# EAGLE design SensorStick_v2 (EAGLE 9.4.2)
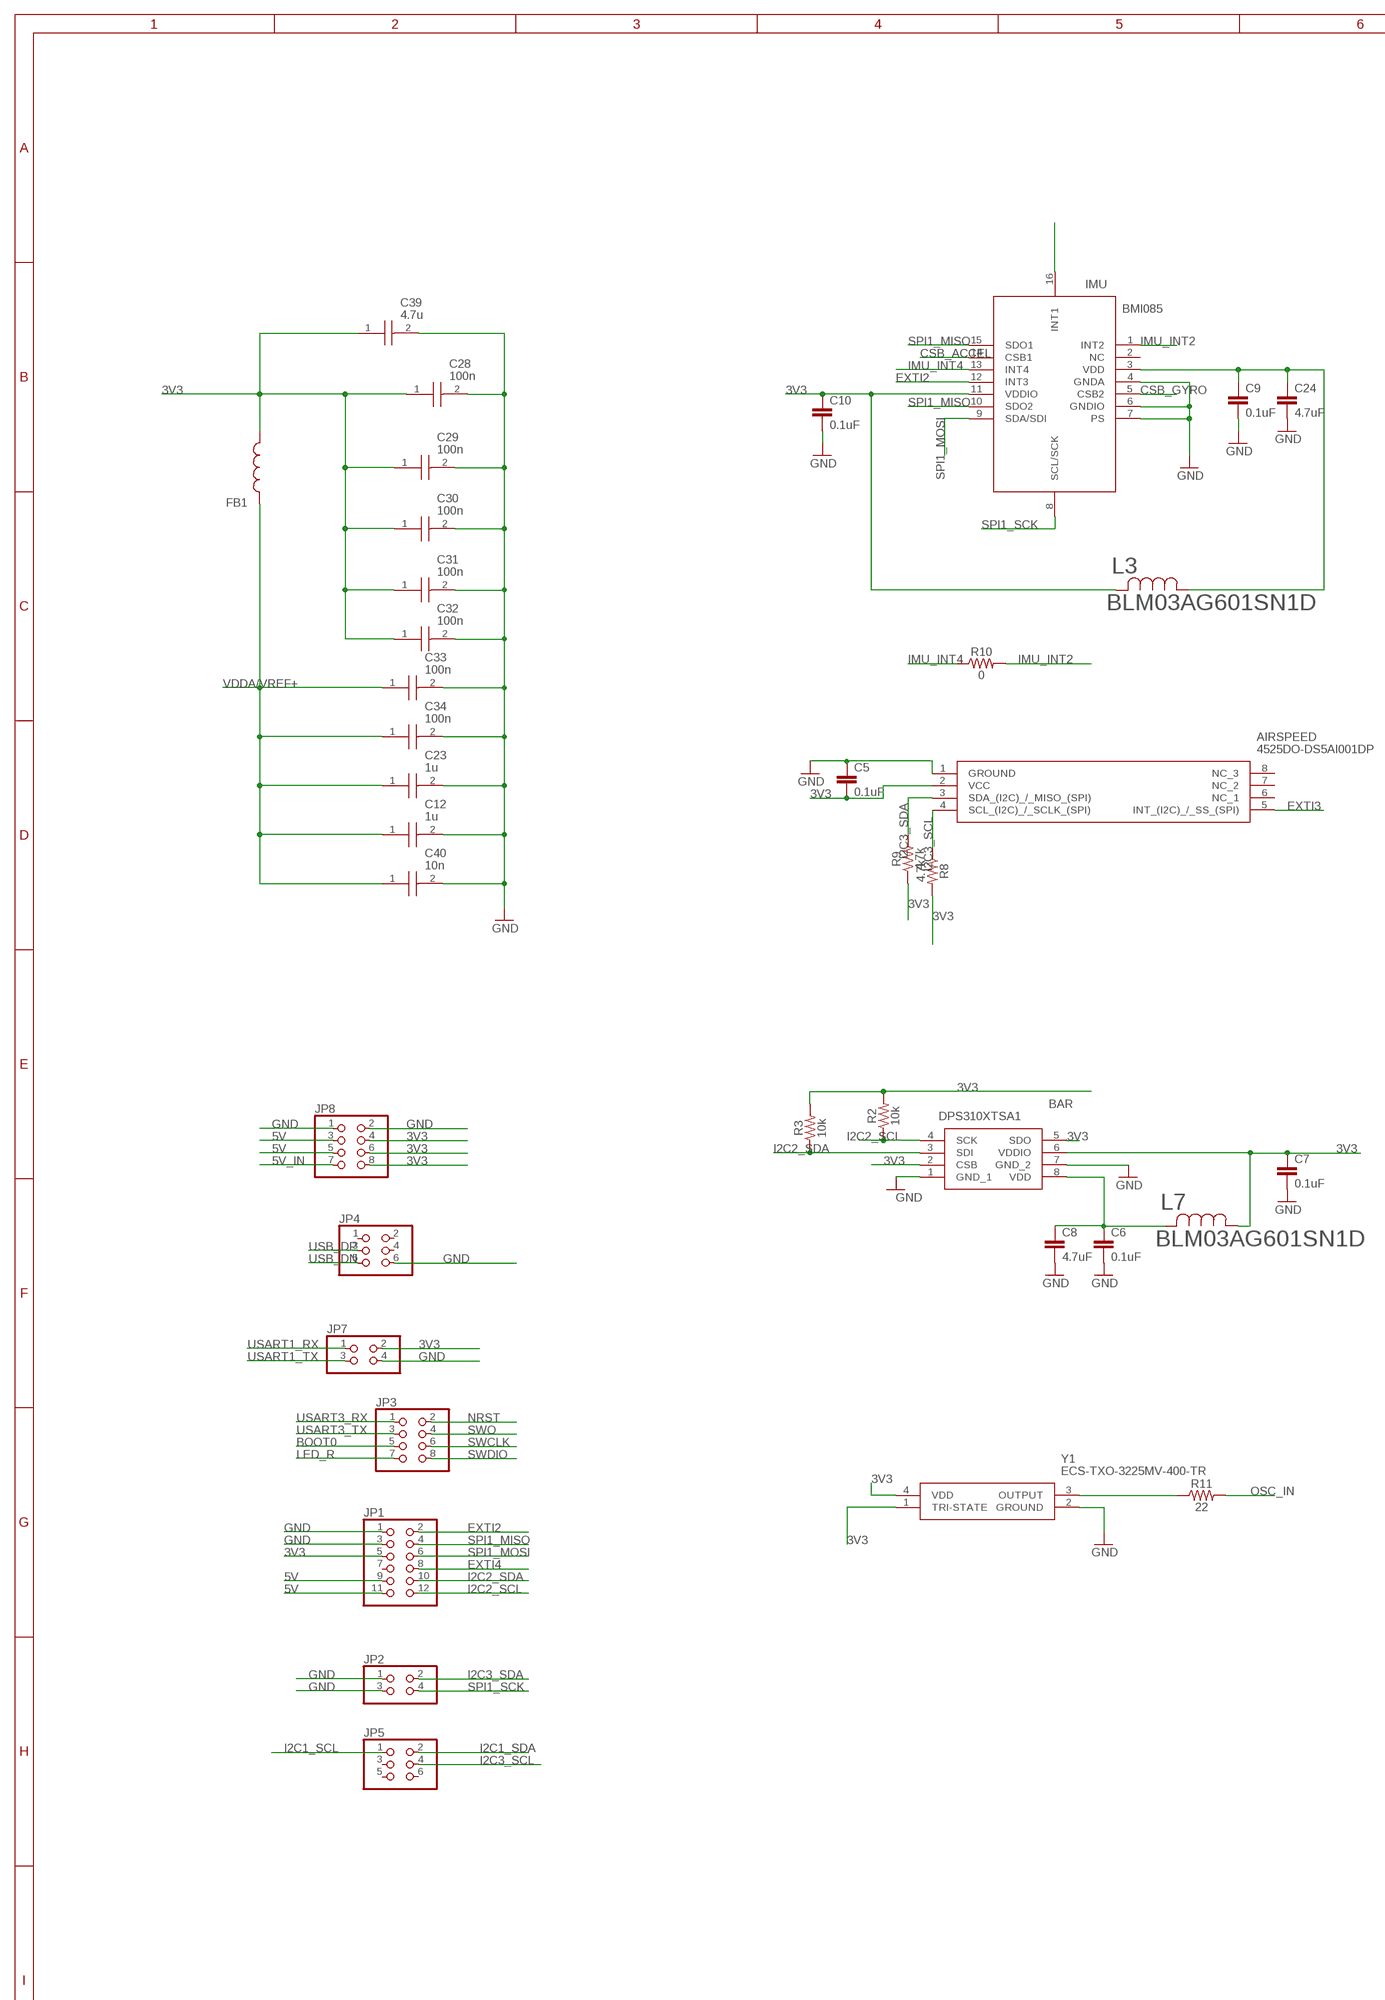
[diagram p0: schematic, sheet 1, part 1 of 2]
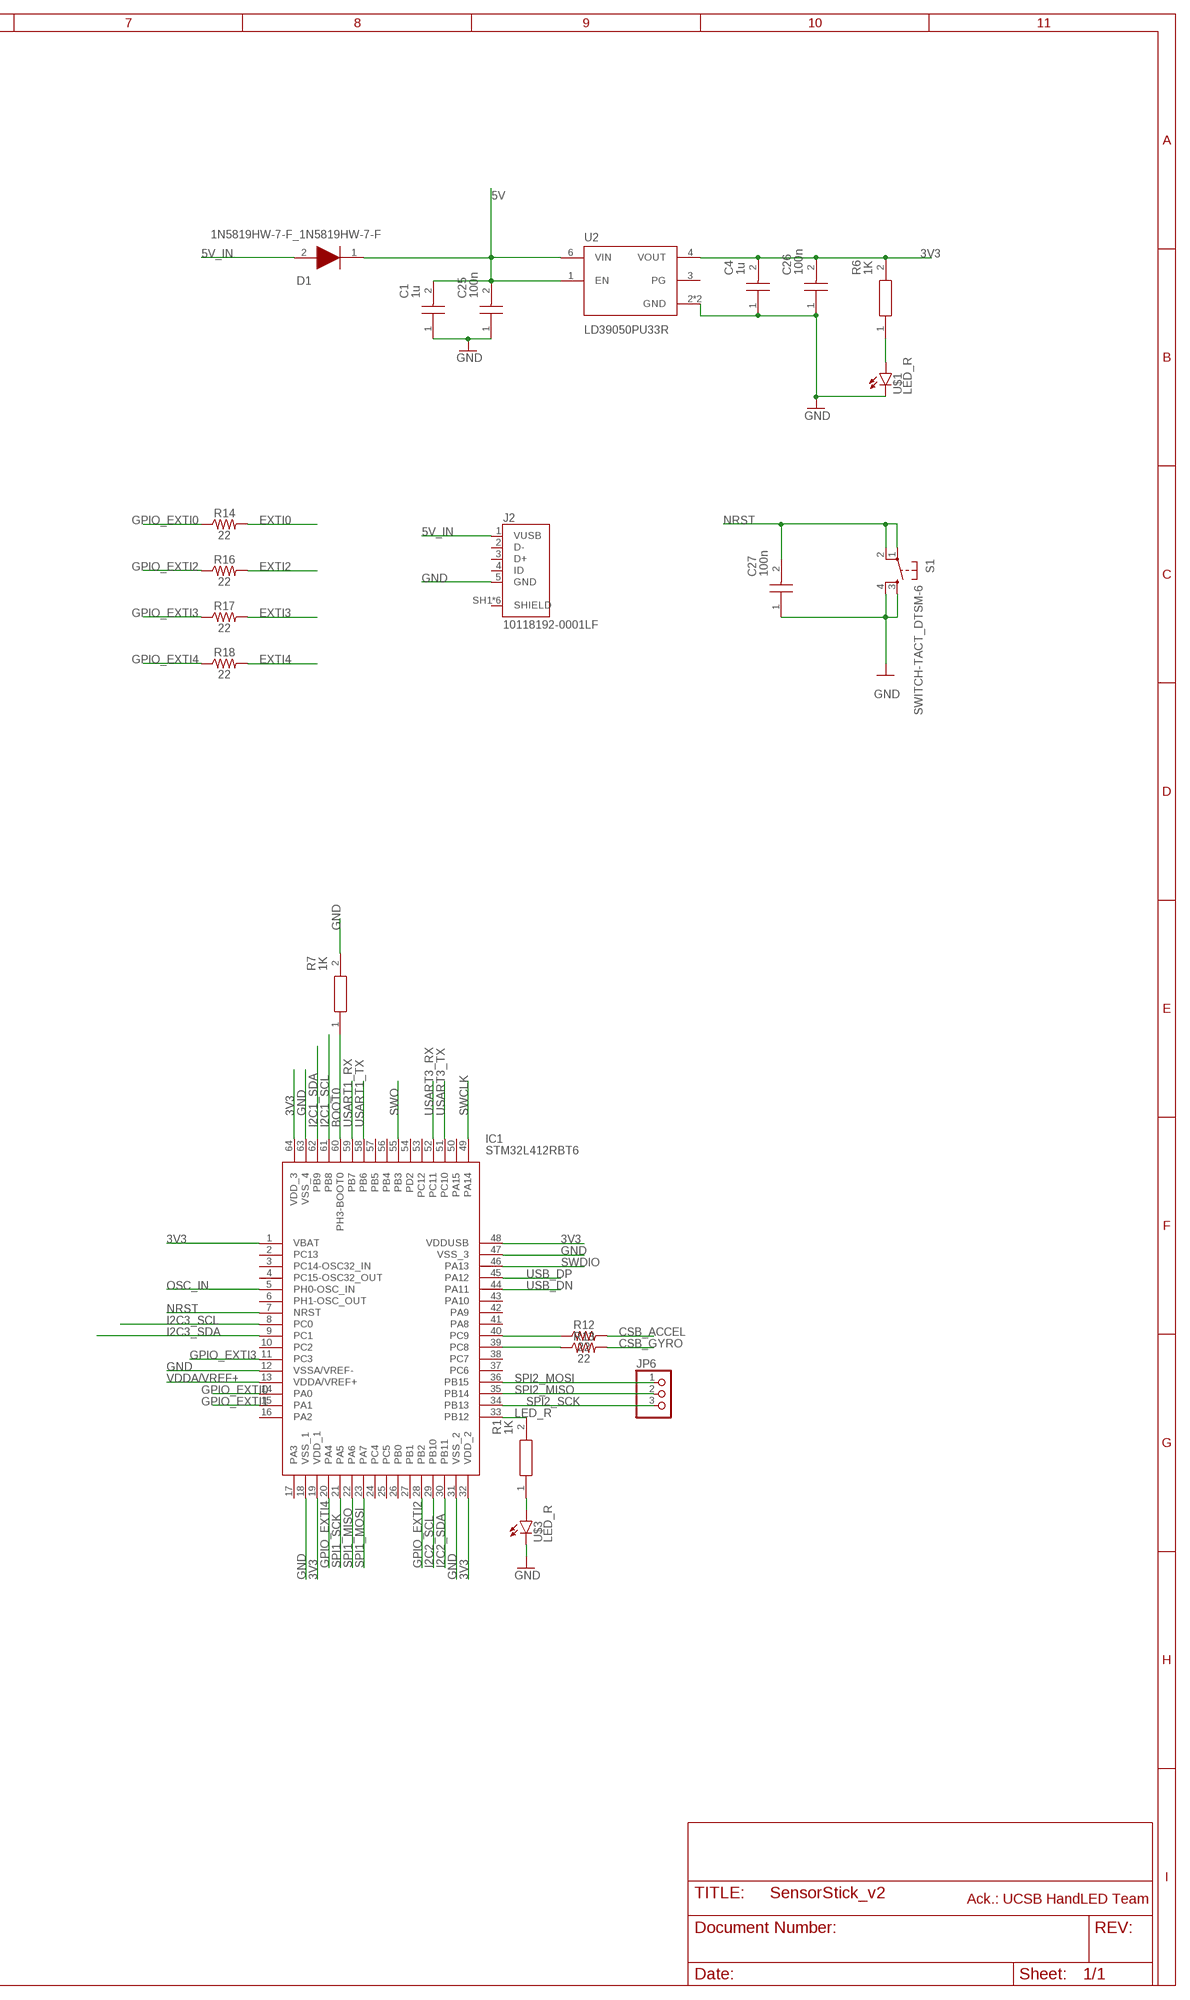
[diagram p1: schematic, sheet 1, part 2 of 2]

## Parts
AIRSPEED  4525DO-DS5AI001DP  [4525DO-DS...P]
BAR  DPS310XTSA1  [DPS310XTSA1]
C1  1u  GRM219R61H105KA73D  [CAPC2012X95N]
C4  1u  GRM219R61H105KA73D  [CAPC2012X95N]
C5  0.1uF  0.1UF-0402-6.3V-10%-X7R  [0402]
C6  0.1uF  0.1UF-0402-6.3V-10%-X7R  [0402]
C7  0.1uF  0.1UF-0402-6.3V-10%-X7R  [0402]
C8  4.7uF  4.7UF0603  [0603]
C9  0.1uF  0.1UF-0402-6.3V-10%-X7R  [0402]
C10  0.1uF  0.1UF-0402-6.3V-10%-X7R  [0402]
C12  1u  GRM219R61H105KA73D  [CAPC2012X95N]
C23  1u  GRM219R61H105KA73D  [CAPC2012X95N]
C24  4.7uF  4.7UF0603  [0603]
C25  100n  GRT31C5C2A104JA12L  [CAPC3216X180N]
C26  100n  GRT31C5C2A104JA12L  [CAPC3216X180N]
C27  100n  GRT31C5C2A104JA12L  [CAPC3216X180N]
C28  100n  GRT31C5C2A104JA12L  [CAPC3216X180N]
C29  100n  GRT31C5C2A104JA12L  [CAPC3216X180N]
C30  100n  GRT31C5C2A104JA12L  [CAPC3216X180N]
C31  100n  GRT31C5C2A104JA12L  [CAPC3216X180N]
C32  100n  GRT31C5C2A104JA12L  [CAPC3216X180N]
C33  100n  GRT31C5C2A104JA12L  [CAPC3216X180N]
C34  100n  GRT31C5C2A104JA12L  [CAPC3216X180N]
C39  4.7u  GRT21BC71H475KE13L  [CAPC2012X145N]
C40  10n  GRM31CR73A103KW03L  [CAPC3216X180N]
D1  1N5819HW-7-F_1N5819HW-7-F  [1N5819HW-7-F_SOD3716X145N]
FB1  BK1608HS601-T  [BEADC1608X95N]
IC1  STM32L412RBT6  STM32L412RBT6P  [QFP50P1200X1200X160-64N]
IMU  BMI085  [BMI085]
J2  10118192-0001LF  [AMPHENOL_10118192-0001LF]
JP1  PINHD-2X6  [2X06]
JP2  PINHD-2X2  [2X02]
JP3  PINHD-2X4  [2X04]
JP4  PINHD-2X3  [2X03]
JP5  PINHD-2X3  [2X03]
JP6  PINHD-1X3  [1X03]
JP7  PINHD-2X2  [2X02]
JP8  PINHD-2X4  [2X04]
L3  BLM03AG601SN1D  [IND_BLM03_0201_MUR]
L7  BLM03AG601SN1D  [IND_BLM03_0201_MUR]
R1  1K  RC0805FR-131KL  [RESC2012X60N]
R2  10k  10KOHM-0402-1/16W-1%  [0402]
R3  10k  10KOHM-0402-1/16W-1%  [0402]
R6  1K  RC0805FR-131KL  [RESC2012X60N]
R7  1K  RC0805FR-131KL  [RESC2012X60N]
R8  4.7k  4.7KOHM-0603-1/10W-1%  [0603]
R9  4.7k  4.7KOHM-0603-1/10W-1%  [0603]
R10  0  0OHM-0603-1/10W-5%  [0603]
R11  22  22OHM-0402-1/10W-1%  [0402]
R12  22  22OHM-0402-1/10W-1%  [0402]
R13  22  22OHM-0402-1/10W-1%  [0402]
R14  22  22OHM-0402-1/10W-1%  [0402]
R16  22  22OHM-0402-1/10W-1%  [0402]
R17  22  22OHM-0402-1/10W-1%  [0402]
R18  22  22OHM-0402-1/10W-1%  [0402]
S1  SWITCH-TACT_DTSM-6  [SWITCH-TACT_DTSM-6]
U2  LD39050PU33R  [SON95P300X300X100-7N]
U$1  LED_R  SML-P12VTT86  [LED_SML-P11UTT86R]
U$3  LED_R  SML-P12VTT86  [LED_SML-P11UTT86R]
Y1  ECS-TXO-3225MV-400-TR  [ECSTXO3225MV400TR]

## Nets
3V3: AIRSPEED.2(VCC) BAR.2(CSB) BAR.5(SDO) BAR.6(VDDIO) C4.2 C5.2 C7.1 C10.1 C26.2 C28.1 C29.1 C30.1 C31.1 C32.1 C39.1 FB1.2 IC1.1(VBAT) IC1.19(VDD_1) IC1.32(VDD_2) IC1.48(VDDUSB) IC1.64(VDD_3) IMU.11(VDDIO) JP1.5 JP7.2 JP8.4 JP8.6 JP8.8 L3.2 L7.1 R2.2 R3.2 R6.2 R8.2 R9.1 U2.4(VOUT) Y1.1(TRI-STATE) Y1.4(VDD)
5V: C1.2 C25.2 D1.1(K) JP1.9 JP1.11 JP8.3 JP8.5 U2.1(EN) U2.6(VIN)
5V_IN: D1.2(A) J2.1(VUSB) JP8.7
BOOT0: IC1.60(PH3-BOOT0) JP3.5 R7.1
CSB_ACCEL: IMU.14(CSB1) R12.2
CSB_GYRO: IMU.5(CSB2) R13.2
EXTI0: IMU.16(INT1) R14.2
EXTI2: IMU.12(INT3) JP1.2 R16.2
EXTI3: AIRSPEED.5(INT_(I2C)_/_SS_(SPI)) R17.2
EXTI4: JP1.8 R18.2
GND: AIRSPEED.1(GROUND) BAR.1(GND_1) BAR.7(GND_2) C1.1 C4.1 C5.1 C6.2 C7.2 C8.2 C9.2 C10.2 C12.2 C23.2 C24.2 C25.1 C26.1 C27.1 C28.2 C29.2 C30.2 C31.2 C32.2 C33.2 C34.2 C39.2 C40.2 IC1.12(VSSA/VREF-) IC1.18(VSS_1) IC1.31(VSS_2) IC1.47(VSS_3) IC1.63(VSS_4) IMU.4(GNDA) IMU.6(GNDIO) IMU.7(PS) J2.5(GND) JP1.1 JP1.3 JP2.1 JP2.3 JP4.6 JP7.4 JP8.1 JP8.2 R7.2 S1.3 S1.4 U2.2(GND) U2.7(GND) U$1.C U$3.C Y1.2(GROUND)
GPIO_EXTI0: IC1.14(PA0) R14.1
GPIO_EXTI1: IC1.15(PA1)
GPIO_EXTI2: IC1.28(PB2) R16.1
GPIO_EXTI3: IC1.11(PC3) R17.1
GPIO_EXTI4: IC1.20(PA4) R18.1
I2C1_SCL: IC1.61(PB8) JP5.1
I2C1_SDA: IC1.62(PB9) JP5.2
I2C2_SCL: BAR.4(SCK) IC1.29(PB10) JP1.12 R2.1
I2C2_SDA: BAR.3(SDI) IC1.30(PB11) JP1.10 R3.1
I2C3_SCL: AIRSPEED.4(SCL_(I2C)_/_SCLK_(SPI)) IC1.8(PC0) JP5.4 R8.1
I2C3_SDA: AIRSPEED.3(SDA_(I2C)_/_MISO_(SPI)) IC1.9(PC1) JP2.2 R9.2
IMU_INT2: IMU.1(INT2) R10.2
IMU_INT4: IMU.13(INT4) R10.1
LED_R: IC1.33(PB12) JP3.7 R1.2
N$1: IC1.39(PC8) R13.1
N$2: R1.1 U$3.A
N$3: R11.1 Y1.3(OUTPUT)
N$4: IC1.40(PC9) R12.1
N$5: R6.1 U$1.A
N$6: BAR.8(VDD) C6.1 C8.1 L7.2
N$8: C9.1 C24.1 IMU.3(VDD) L3.1
NRST: C27.2 IC1.7(NRST) JP3.2 S1.1 S1.2
OSC_IN: IC1.5(PH0-OSC_IN) R11.2
SPI1_MISO: IC1.22(PA6) IMU.10(SDO2) IMU.15(SDO1) JP1.4
SPI1_MOSI: IC1.23(PA7) IMU.9(SDA/SDI) JP1.6
SPI1_SCK: IC1.21(PA5) IMU.8(SCL/SCK) JP2.4
SPI2_MISO: IC1.35(PB14) JP6.2
SPI2_MOSI: IC1.36(PB15) JP6.1
SPI2_SCK: IC1.34(PB13) JP6.3
SWCLK: IC1.49(PA14) JP3.6
SWDIO: IC1.46(PA13) JP3.8
SWO: IC1.55(PB3) JP3.4
USART1_RX: IC1.59(PB7) JP7.1
USART1_TX: IC1.58(PB6) JP7.3
USART3_RX: IC1.52(PC11) JP3.1
USART3_TX: IC1.51(PC10) JP3.3
USB_DN: IC1.44(PA11) JP4.5
USB_DP: IC1.45(PA12) JP4.3
VDDA/VREF+: C12.1 C23.1 C33.1 C34.1 C40.1 FB1.1 IC1.13(VDDA/VREF+)
Unconnected: AIRSPEED.6(NC_1) AIRSPEED.7(NC_2) AIRSPEED.8(NC_3) IC1.2(PC13) IC1.3(PC14-OSC32_IN) IC1.4(PC15-OSC32_OUT) IC1.6(PH1-OSC_OUT) IC1.10(PC2) IC1.16(PA2) IC1.17(PA3) IC1.24(PC4) IC1.25(PC5) IC1.26(PB0) IC1.27(PB1) IC1.37(PC6) IC1.38(PC7) IC1.41(PA8) IC1.42(PA9) IC1.43(PA10) IC1.50(PA15) IC1.53(PC12) IC1.54(PD2) IC1.56(PB4) IC1.57(PB5) IMU.2(NC) J2.2(D-) J2.3(D+) J2.4(ID) J2.SH1(SHIELD) J2.SH2(SHIELD) J2.SH3(SHIELD) J2.SH4(SHIELD) J2.SH5(SHIELD) J2.SH6(SHIELD) JP1.7 JP4.1 JP4.2 JP4.4 JP5.3 JP5.5 JP5.6 U2.3(PG)

## Notes on the sheet
- Ack.: UCSB HandLED Team

## Library data of the parts
AIRSPEED = 4525DO-DS5AI001DP:4525DO-DS5AI001DP: Differential Pressure Sensor 1PSI Dual Barbs Source: Datasheet <http://www.te.com/commerce/DocumentDelivery/DDEController?Action=srchrtrv&DocNm=MS4525DO&DocType=DS&DocLang=English>; ARROW_PART_NUMBER: 4525DO-DS5AI001DP; ARROW_PRICE-STOCK: https://www.arrow.com/en/products/4525do-ds5ai001dp/te-connectivity; DESCRIPTION: Differential Pressure Sensor 1PSI Dual Barbs; HEIGHT: mm; MANUFACTURER_NAME: TE Connectivity; MANUFACTURER_PART_NUMBER: 4525DO-DS5AI001DP; MOUSER_PART_NUMBER: 824-4525DODS5AI001DP; MOUSER_PRICE-STOCK: https://www.mouser.co.uk/ProductDetail/Measurement-Specialties/4525DO-DS5AI001DP?qs=oFx6pF86PmDUpUCTX7loEA%3D%3D
BAR = DPS310XTSA1:DPS310XTSA1: INFINEON - DPS310XTSA1 - DIGITAL PRESSURE SENSOR, 1200HPA, VLGA-8 Source: Datasheet <https://www.infineon.com/dgdl/Infineon-DPS310-DS-v01_00-EN.pdf?fileId=5546d462576f34750157750826c42242>; ARROW_PART_NUMBER: DPS310XTSA1; ARROW_PRICE-STOCK: https://www.arrow.com/en/products/dps310xtsa1/infineon-technologies-ag?region=nac; DESCRIPTION: INFINEON - DPS310XTSA1 - DIGITAL PRESSURE SENSOR, 1200HPA, VLGA-8; HEIGHT: 1.01mm; MANUFACTURER_NAME: Infineon; MANUFACTURER_PART_NUMBER: DPS310XTSA1; MOUSER_PART_NUMBER: 726-DPS310XTSA1; MOUSER_PRICE-STOCK: https://www.mouser.co.uk/ProductDetail/Infineon-Technologies/DPS310XTSA1?qs=uuTTuBTXn66Ynca8WHwycg%3D%3D
C1 C4 C12 C23 = GRM219R61H105KA73D(1u):GRM219R61H105KA73D: MURATA - GRM219R61H105KA73D - CAP, MLCC, X5R, 1UF, 50V, 0805 Source: Datasheet <https://datasheet.datasheetarchive.com/originals/distributors/DKDS-10/191852.pdf>; DESCRIPTION: MURATA - GRM219R61H105KA73D - CAP, MLCC, X5R, 1UF, 50V, 0805; HEIGHT: 0.95mm; MANUFACTURER_NAME: Murata Electronics; MANUFACTURER_PART_NUMBER: GRM219R61H105KA73D; MOUSER_PART_NUMBER: 81-GRM219R61H105KA3D; MOUSER_PRICE-STOCK: https://www.mouser.co.uk/ProductDetail/Murata-Electronics/GRM219R61H105KA73D?qs=O5cugoO6nweiD1nCQ5vS9w%3D%3D
C5 = SparkFun-Capacitors:0.1UF: 0.1µF ceramic capacitors A capacitor is a passive two-terminal electrical component used to store electrical energy temporarily in an electric field.; PROD_ID: CAP-14993; SPICEPREFIX: C
C6 C7 C9 C10 = SparkFun-Capacitors:0.1UF: 0.1µF ceramic capacitors A capacitor is a passive two-terminal electrical component used to store electrical energy temporarily in an electric field.; PROD_ID: CAP-14993
C8 C24 = SparkFun-Capacitors:4.7UF: 4.7µF ceramic capacitors A capacitor is a passive two-terminal electrical component used to store electrical energy temporarily in an electric field.; PROD_ID: CAP-08280
C25-C34 = GRT31C5C2A104JA12L(0_1u):GRT31C5C2A104JA12L: Multilayer Ceramic Capacitors MLCC - SMD/SMT Source: Datasheet <https://www.murata.com/en-eu/products/productdetail?partno=GRT31C5C2A104JA12#>; DESCRIPTION: Multilayer Ceramic Capacitors MLCC - SMD/SMT; HEIGHT: 1.8mm; MANUFACTURER_NAME: Murata Electronics; MANUFACTURER_PART_NUMBER: GRT31C5C2A104JA12L; MOUSER_PART_NUMBER: 81-GRT31C5C2A104JA2L; MOUSER_PRICE-STOCK: https://www.mouser.co.uk/ProductDetail/Murata-Electronics/GRT31C5C2A104JA12L?qs=rI7uf1IzohSpYGEFBFd58g%3D%3D
C39 = GRT21BC71H475KE13L(4_7u):GRT21BC71H475KE13L: GRT21BC71H475KE13_ (0805, X7S:EIA, 4.7uF, DC50V) Source: Datasheet <https://search.murata.co.jp/Ceramy/image/img/A01X/G101/ENG/GRT21BC71H475KE13-01.pdf>; DESCRIPTION: GRT21BC71H475KE13_ (0805, X7S:EIA, 4.7uF, DC50V); HEIGHT: 1.45mm; MANUFACTURER_NAME: Murata Electronics; MANUFACTURER_PART_NUMBER: GRT21BC71H475KE13L; MOUSER_PART_NUMBER: 81-GRT21BC71H475KE3L; MOUSER_PRICE-STOCK: https://www.mouser.co.uk/ProductDetail/Murata-Electronics/GRT21BC71H475KE13L?qs=rI7uf1IzohQrtwc9u30k7A%3D%3D
C40 = GRM31CR73A103KW03L(0_01u):GRM31CR73A103KW03L: Murata 3216 GRM 10000pF Ceramic Multilayer Capacitor, 1000 V dc, +125C, X7R Dielectric, +/-10% Source: Datasheet <https://datasheet.datasheetarchive.com/originals/distributors/DKDS-10/192419.pdf>; DESCRIPTION: Murata 3216 GRM 10000pF Ceramic Multilayer Capacitor, 1000 V dc, +125C, X7R Dielectric, +/-10%; HEIGHT: 1.8mm; MANUFACTURER_NAME: Murata Electronics; MANUFACTURER_PART_NUMBER: GRM31CR73A103KW03L; MOUSER_PART_NUMBER: 81-GRM31CR73A103KW3L; MOUSER_PRICE-STOCK: https://www.mouser.co.uk/ProductDetail/Murata-Electronics/GRM31CR73A103KW03L?qs=hNud%2FORuBR1TymPCs4fJcA%3D%3D
D1 = ce-capstone-2022:1N5819HW-7-F_1N5819HW-7-F: Diode Schottky 1A 40V SOD123 Diodes Inc 1N5819HW-7-F, SMT Schottky Diode, 40V 1A, 2-Pin SOD-123 Source: Datasheet <https://datasheet.datasheetarchive.com/originals/distributors/Datasheets-DGA23/1390892.pdf>; ARROW_PART_NUMBER: 1N5819HW-7-F; ARROW_PRICE-STOCK: https://www.arrow.com/en/products/1n5819hw-7-f/diodes-incorporated; DESCRIPTION: Diode Schottky 1A 40V SOD123 Diodes Inc 1N5819HW-7-F, SMT Schottky Diode, 40V 1A, 2-Pin SOD-123; HEIGHT: 1.45mm; MANUFACTURER_NAME: Diodes Inc.; MANUFACTURER_PART_NUMBER: 1N5819HW-7-F; MOUSER_PART_NUMBER: 621-1N5819HW-F; MOUSER_PRICE-STOCK: https://www.mouser.co.uk/ProductDetail/Diodes-Incorporated/1N5819HW-7-F?qs=NQ47qNm99eDyWTEd07miYA%3D%3D
FB1 = ce-capstone:BK1608HS601-T: Ferrite Chip Bead(Lead Free) Source: Datasheet <https://www.tai-tech.com.tw/_upload/files/FCM1608-Series.pdf>; DESCRIPTION: Ferrite Chip Bead(Lead Free); HEIGHT: 0.95mm; MANUFACTURER_NAME: Taiyo Yuden; MANUFACTURER_PART_NUMBER: BK1608HS601-T
IC1 = STM32L412RBT6P:STM32L412RBT6P: ARM Microcontrollers - MCU Source: Datasheet <https://www.st.com/resource/en/datasheet/stm32l412c8.pdf>; DESCRIPTION: ARM Microcontrollers - MCU; HEIGHT: 1.6mm; MANUFACTURER_NAME: STMicroelectronics; MANUFACTURER_PART_NUMBER: STM32L412RBT6P; MOUSER_PART_NUMBER: 511-STM32L412RBT6P; MOUSER_PRICE-STOCK: https://www.mouser.co.uk/ProductDetail/STMicroelectronics/STM32L412RBT6P?qs=l7cgNqFNU1hh%252BU1wOZs5Xg%3D%3D
IMU = BMI085:BMI085: IMUs - Inertial Measurement Units High-performance IMU BMI085 for virtual and augmented reality applications Source: Datasheet <https://ae-bst.resource.bosch.com/media/_tech/media/datasheets/BST-BMI085-DS001.pdf>; ARROW_PART_NUMBER: BMI085; ARROW_PRICE-STOCK: https://www.arrow.com/en/products/bmi085/bosch; DESCRIPTION: IMUs - Inertial Measurement Units High-performance IMU BMI085 for virtual and augmented reality applications; HEIGHT: 1mm; MANUFACTURER_NAME: Bosch Sensortec; MANUFACTURER_PART_NUMBER: BMI085; MOUSER_PART_NUMBER: 262-BMI085; MOUSER_PRICE-STOCK: https://www.mouser.co.uk/ProductDetail/Bosch-Sensortec/BMI085?qs=y6ZabgHbY%252ByGCM8LfWZyqA%3D%3D
J2 = ce-capstone:10118192-0001LF: Single Port 5 Contact Horizontal Right Angle Shielded Micro B USB 2.0 Connector; AVAILABILITY: Unavailable; DESCRIPTION: USB - micro B USB 2.0 Receptacle Connector 5 Position Surface Mount, Right Angle; MF: Amphenol ICC; MP: 10118192-0001LF; PACKAGE: None; PRICE: None
JP1 = pinhead:PINHD-2X6: PIN HEADER
JP2 JP7 = pinhead:PINHD-2X2: PIN HEADER
JP3 JP8 = pinhead:PINHD-2X4: PIN HEADER
JP4 JP5 = pinhead:PINHD-2X3: PIN HEADER
JP6 = pinhead:PINHD-1X3: PIN HEADER
L3 L7 = BLM03AG601SN1D:BLM03AG601SN1D; COPYRIGHT: Copyright (C) 2023 Ultra Librarian. All rights reserved.; DIGI-KEY_PART_NUMBER_1: 490-5164-1-ND; DIGI-KEY_PART_NUMBER_2: 490-5164-2-ND; DIGI-KEY_PART_NUMBER_3: 490-5164-6-ND; MANUFACTURER_PART_NUMBER: BLM03AG601SN1D; MFR_NAME: Murata
R1 R6 R7 = RC0805FR-131KL:RC0805FR-131KL: Thick Film Resistors - SMD 1 kOhms 250 mW 0805 1% Source: Datasheet <https://datasheet.datasheetarchive.com/originals/distributors/Datasheets_SAMA/902f9e387b938f871d31120f5fc1d65e.pdf>; DESCRIPTION: Thick Film Resistors - SMD 1 kOhms 250 mW 0805 1%; HEIGHT: 0.6mm; MANUFACTURER_NAME: KEMET; MANUFACTURER_PART_NUMBER: RC0805FR-131KL; MOUSER_PART_NUMBER: 603-RC0805FR-131KL; MOUSER_PRICE-STOCK: https://www.mouser.co.uk/ProductDetail/YAGEO/RC0805FR-131KL?qs=m6lXFsvg5e0qJLgmV7HC3Q%3D%3D
R2 R3 = SparkFun-Resistors:10KOHM: 10kΩ resistor A resistor is a passive two-terminal electrical component that implements electrical resistance as a circuit element. Resistors act to reduce current flow, and, at the same time, act to lower voltage levels within circuits. - Wikipedia; PROD_ID: RES-14241
R8 R9 = SparkFun-Resistors:4.7KOHM: 4.7kΩ resistor A resistor is a passive two-terminal electrical component that implements electrical resistance as a circuit element. Resistors act to reduce current flow, and, at the same time, act to lower voltage levels within circuits. - Wikipedia; PROD_ID: RES-07857
R10 = SparkFun-Resistors:0OHM: 0Ω resistor A resistor is a passive two-terminal electrical component that implements electrical resistance as a circuit element. Resistors act to reduce current flow, and, at the same time, act to lower voltage levels within circuits. - Wikipedia; PROD_ID: RES-08609
R11-R14 R16-R18 = SparkFun-Resistors:22OHM: 22Ω resistor A resistor is a passive two-terminal electrical component that implements electrical resistance as a circuit element. Resistors act to reduce current flow, and, at the same time, act to lower voltage levels within circuits. - Wikipedia; PROD_ID: RES-12427
S1 = ce-capstone-2022:SWITCH-TACT_DTSM-6
U2 = ce-capstone:LD39050PU33R: LD39050 Series 500 mA 3.3 V Fixed Low Noise LDO Voltage Regulator - DFN-6; AVAILABILITY: Unavailable; DESCRIPTION: Linear Voltage Regulator IC 1 Output 500mA 6-DFN _3x3_; MF: STMicroelectronics; MP: LD39050PU33R; PACKAGE: DFN-6 STMicroelectronics; PRICE: None
U$1 U$3 = ce-capstone:SML-P12VTT86: SML-P1 Series Red 0402 Clear 60 mcd 2 V Surface Mount PICOLED LED; AVAILABILITY: Unavailable; DESCRIPTION: Red 630nm LED Indication - Discrete 2V 0402 _1006 Metric_; MF: Rohm; MP: SML-P12VTT86; PACKAGE: 0402 Rohm; PRICE: None
Y1 = SamacSys_Parts:ECS-TXO-3225MV-400-TR: TCXO Oscillators 40.000 MHZ Multi-Volt +1.7 3.6V HCMOS TCXO +/-2.5 ppm -30 +85 C 3.2x 2.5mm RoHS Source: Datasheet <https://ecsxtal.com/store/pdf/ECS-TXO-3225MV.pdf>; DESCRIPTION: TCXO Oscillators 40.000 MHZ Multi-Volt +1.7 3.6V HCMOS TCXO +/-2.5 ppm -30 +85 C 3.2x 2.5mm RoHS; HEIGHT: 1.2mm; MANUFACTURER_NAME: ECS; MANUFACTURER_PART_NUMBER: ECS-TXO-3225MV-400-TR

## Board
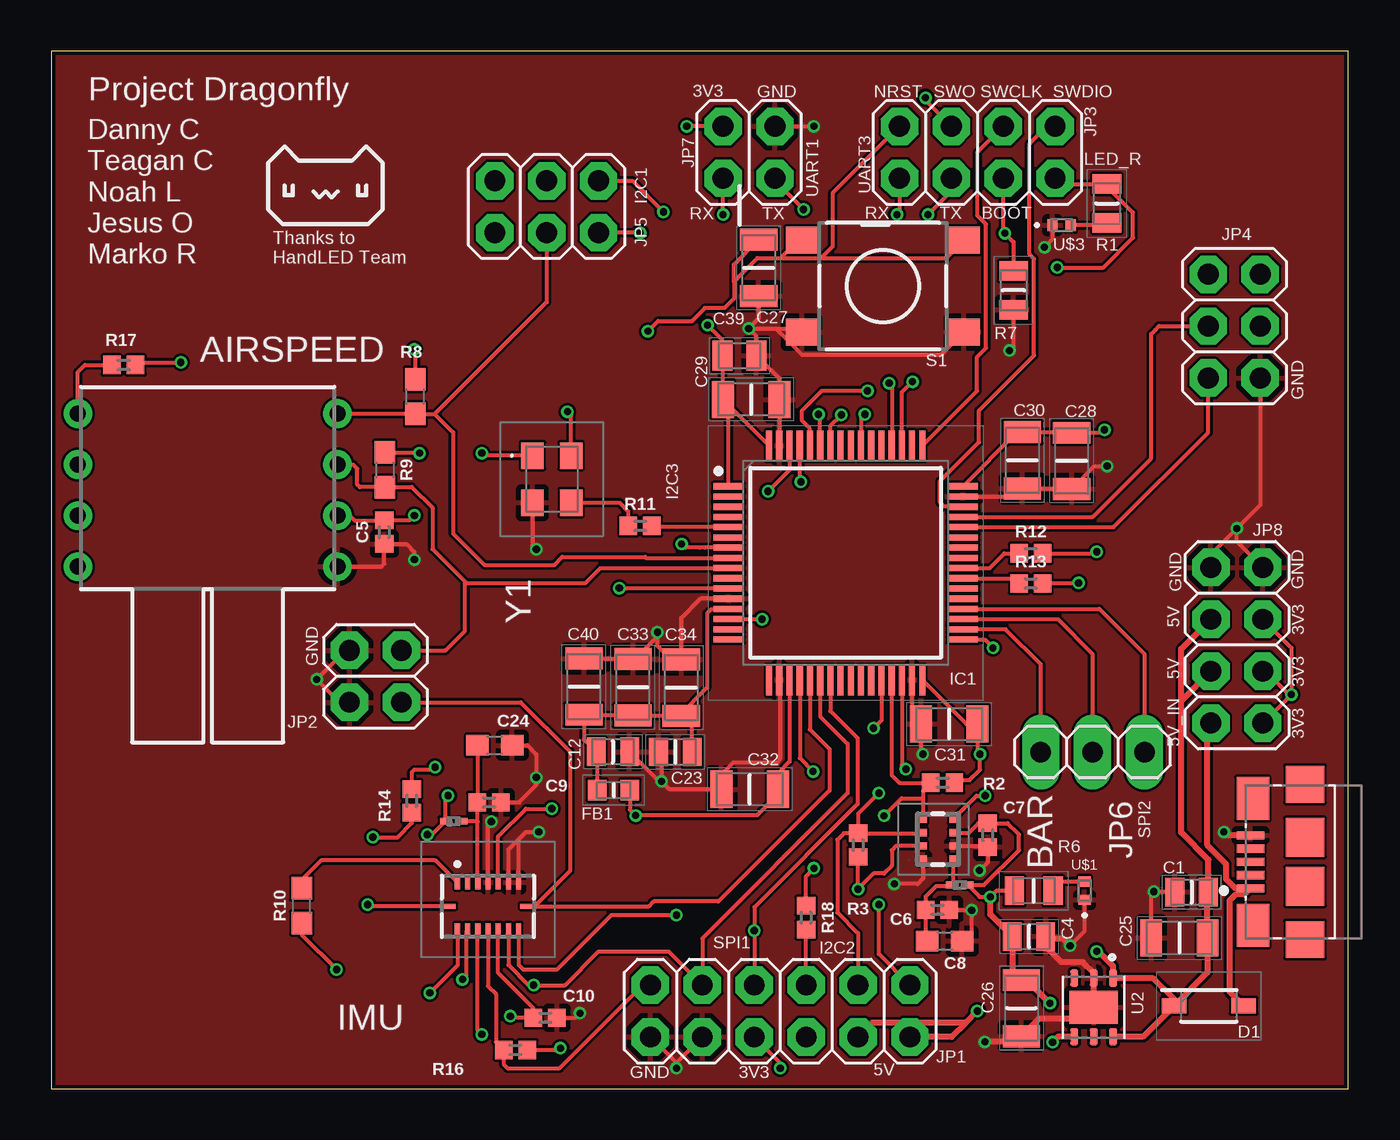
[diagram p2: board, top side]
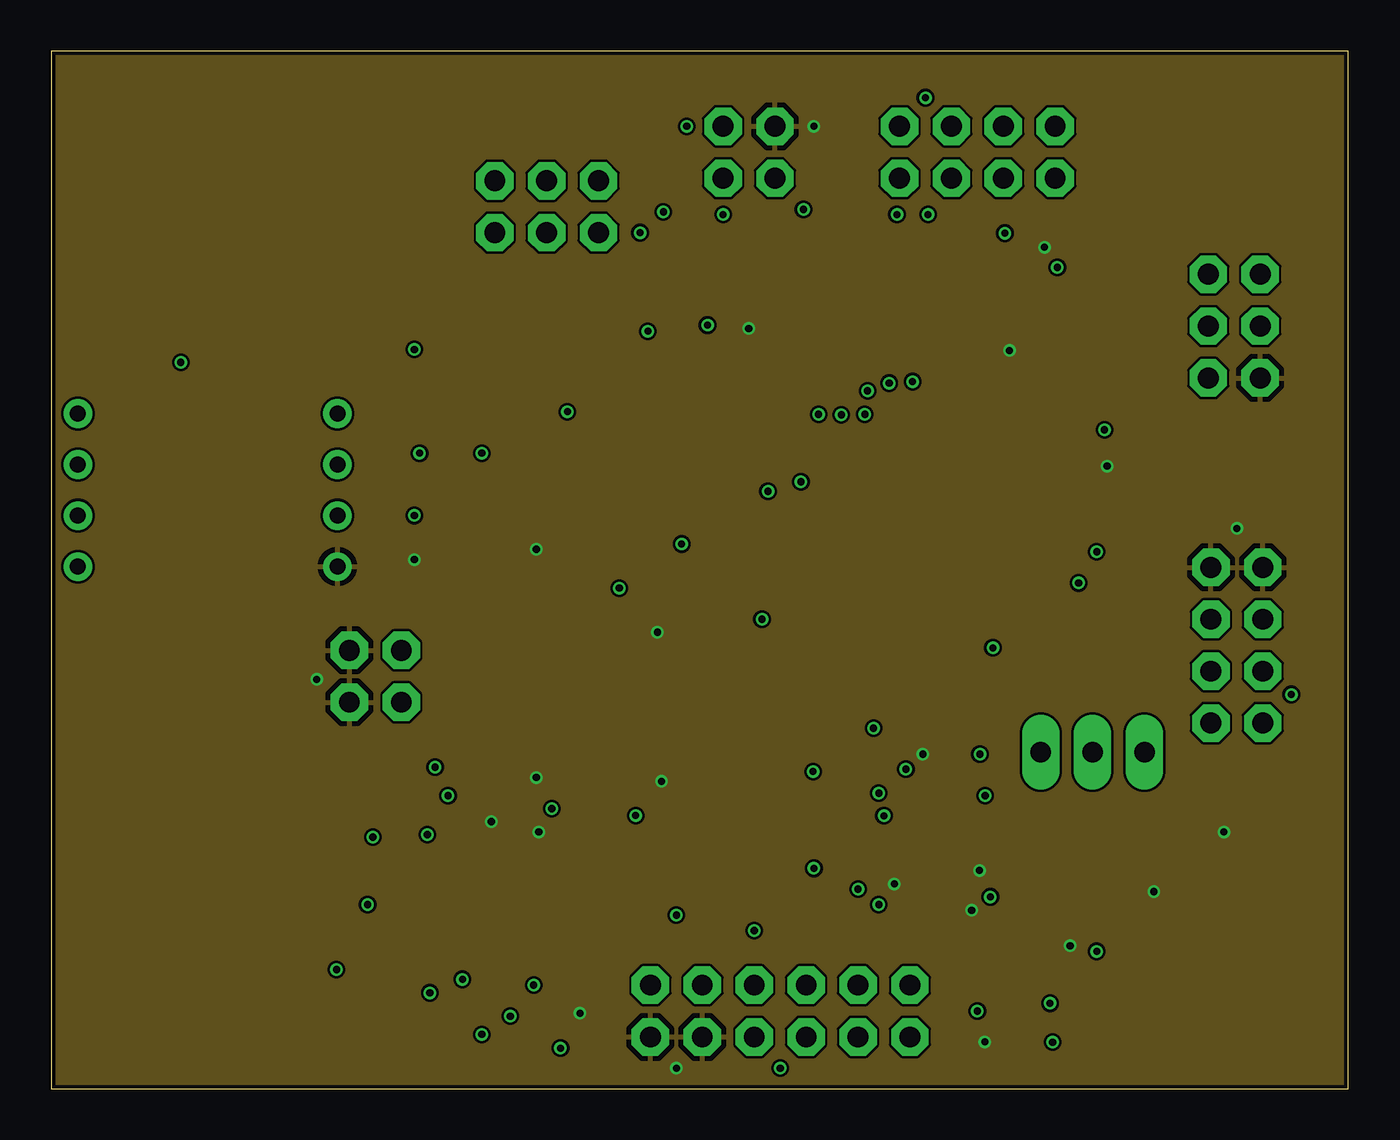
[diagram p3: board, inner layer Route2]
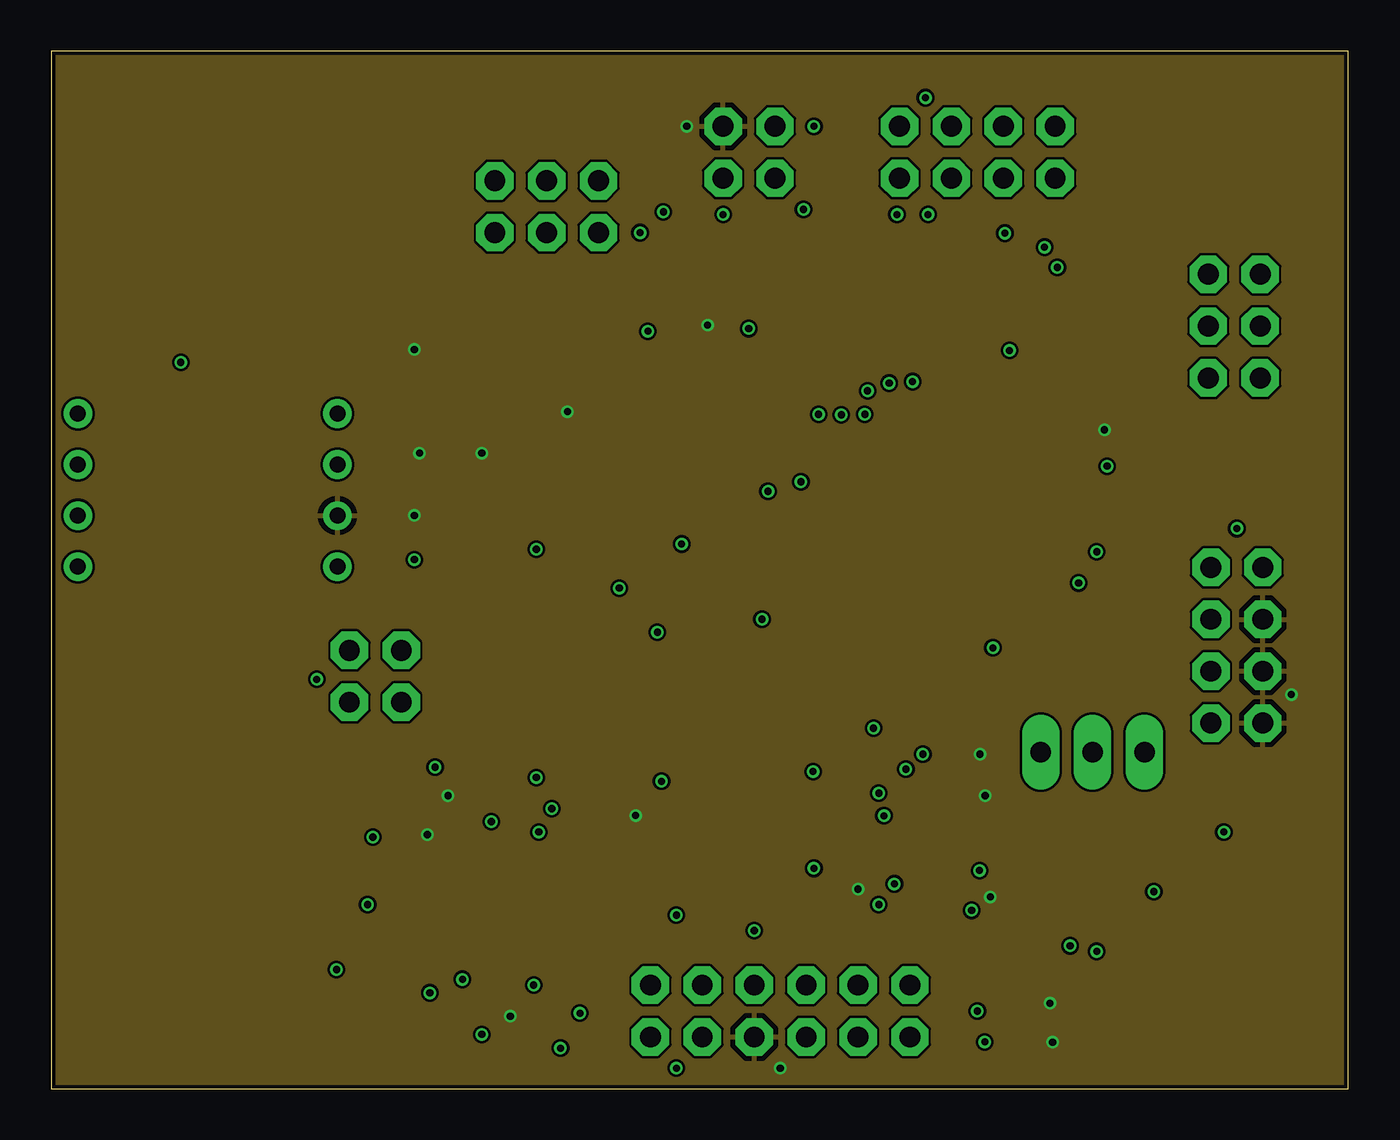
[diagram p4: board, inner layer Route15]
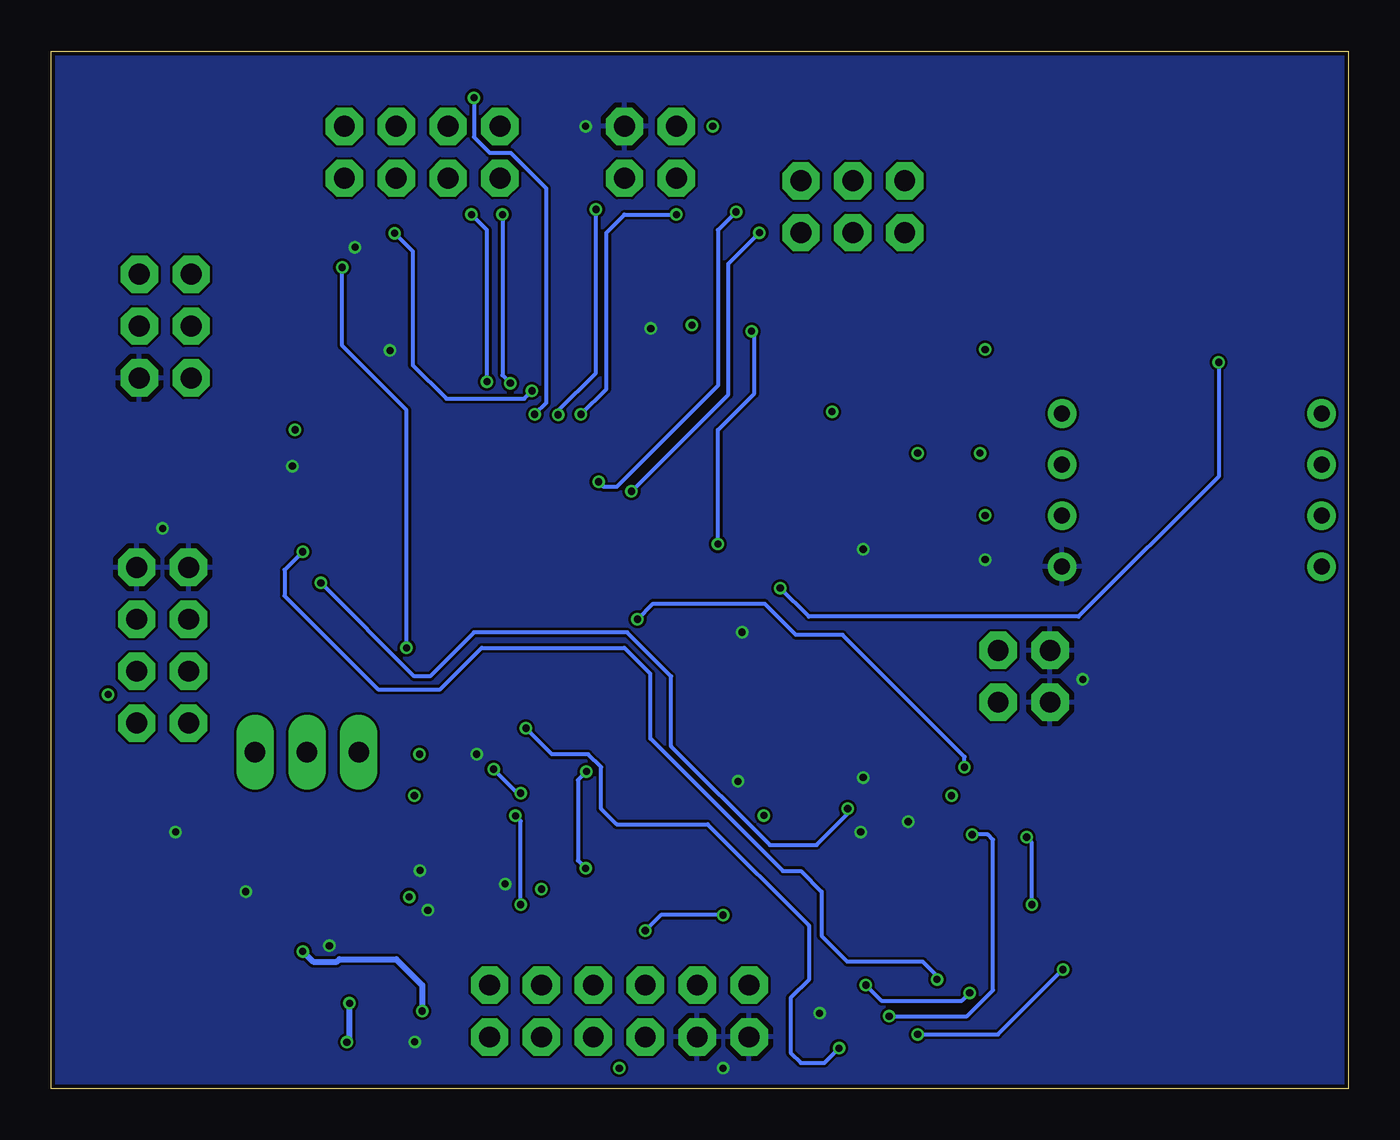
[diagram p5: board, bottom side, seen from below]

Size 63.5 x 50.8 mm. Coordinates in mm from the lower left corner, seen from the top.
Outline: 0,0 63.5,0 63.5,50.8 0,50.8 0,0
Copper layers (1+2*15+16): Top 0.035mm / dielectric 0.2mm / Route2 0.0175mm / dielectric 1.065mm / Route15 0.0175mm / dielectric 0.2mm / Bottom 0.035mm
Design rules "jlcpcb-4layers": minimum track width 3.5mil, minimum drill 0.2mm, track to track 5mil, track to pad 0.2mm, pad to pad 5mil, via to via 0.5mm, smd to smd 5mil, copper to edge 0.2mm, drill to drill 6mil, minimum pad ring 10mil, minimum via ring 0.13mm, stop-mask expansion 0.05mm, vias tented up to drill 16mil, thermal gap 10mil

### Footprints (pad centres in the part's own frame; a part is rotated, then mirrored left to right if it is on the bottom)
4525DO-DS...P = drill 0.78 pad 1.28: 1 1.1,-8.3; 2 3.6,-8.3; 3 6.1,-8.3; 4 8.6,-8.3; 5 8.6,4.4; 6 6.1,4.4; 7 3.6,4.4; 8 1.1,4.4
DPS310XTSA1 = smd 0.35 x 0.35: 1 0.975,-0.725; 2 0.325,-0.725; 3 -0.325,-0.725; 4 -0.975,-0.725; 5 -0.975,0.725; 6 -0.325,0.725; 7 0.325,0.725; 8 0.975,0.725
CAPC2012X95N = smd 0.91 x 1.39: 1 -0.82,0; 2 0.82,0
0402 = smd 0.85 x 0.9: 1 -0.58,0; 2 0.58,0
0603 = smd 1.1 x 1: 1 -0.85,0; 2 0.85,0
CAPC3216X180N = smd 1.07 x 1.82: 1 -1.38,0; 2 1.38,0
CAPC2012X145N = smd 0.97 x 1.47: 1 -0.83,0; 2 0.83,0
1N5819HW-7-F_SOD3716X145N = smd 1.2 x 0.75: 1 -1.7,0; 2 1.7,0
BEADC1608X95N = smd 0.9 x 1: 1 -0.8,0; 2 0.8,0
QFP50P1200X1200X160-64N = smd 1.475 x 0.3: 1 -5.738,3.75; 2 -5.738,3.25; 3 -5.738,2.75; 4 -5.738,2.25; 5 -5.738,1.75; 6 -5.738,1.25; 7 -5.738,0.75; 8 -5.738,0.25; 9 -5.738,-0.25; 10 -5.738,-0.75; 11 -5.738,-1.25; 12 -5.738,-1.75; 13 -5.738,-2.25; 14 -5.738,-2.75; 15 -5.738,-3.25; 16 -5.738,-3.75; 33 5.738,-3.75; 34 5.738,-3.25; 35 5.738,-2.75; 36 5.738,-2.25; 37 5.738,-1.75; 38 5.738,-1.25; 39 5.738,-0.75; 40 5.738,-0.25; 41 5.738,0.25; 42 5.738,0.75; 43 5.738,1.25; 44 5.738,1.75; 45 5.738,2.25; 46 5.738,2.75; 47 5.738,3.25; 48 5.738,3.75 | smd 0.3 x 1.475: 17 -3.75,-5.738; 18 -3.25,-5.738; 19 -2.75,-5.738; 20 -2.25,-5.738; 21 -1.75,-5.738; 22 -1.25,-5.738; 23 -0.75,-5.738; 24 -0.25,-5.738; 25 0.25,-5.738; 26 0.75,-5.738; 27 1.25,-5.738; 28 1.75,-5.738; 29 2.25,-5.738; 30 2.75,-5.738; 31 3.25,-5.738; 32 3.75,-5.738; 49 3.75,5.738; 50 3.25,5.738; 51 2.75,5.738; 52 2.25,5.738; 53 1.75,5.738; 54 1.25,5.738; 55 0.75,5.738; 56 0.25,5.738; 57 -0.25,5.738; 58 -0.75,5.738; 59 -1.25,5.738; 60 -1.75,5.738; 61 -2.25,5.738; 62 -2.75,5.738; 63 -3.25,5.738; 64 -3.75,5.738
BMI085 = smd 0.675 x 0.25: 1 1.165,1.5; 2 1.165,1; 3 1.165,0.5; 4 1.165,0; 5 1.165,-0.5; 6 1.165,-1; 7 1.165,-1.5; 9 -1.165,-1.5; 10 -1.165,-1; 11 -1.165,-0.5; 12 -1.165,0; 13 -1.165,0.5; 14 -1.165,1; 15 -1.165,1.5 | smd 0.25 x 0.675: 8 0,-1.915; 16 0,1.915
AMPHENOL_10118192-0001LF = smd 0.4 x 1.35: 1 -1.3,0; 2 -0.65,0; 3 0,0; 4 0.65,0; 5 1.3,0 | smd 2.1 x 1.6: SH1 -3.1,-0.125; SH2 3.1,-0.125 | smd 1.8 x 1.9: SH3 -3.8,-2.675; SH6 3.8,-2.675 | smd 1.9 x 1.9: SH4 -1.2,-2.675; SH5 1.2,-2.675
2X06 = drill 1.016 octagon: 1 -6.35,-1.27; 2 -6.35,1.27; 3 -3.81,-1.27; 4 -3.81,1.27; 5 -1.27,-1.27; 6 -1.27,1.27; 7 1.27,-1.27; 8 1.27,1.27; 9 3.81,-1.27; 10 3.81,1.27; 11 6.35,-1.27; 12 6.35,1.27
2X02 = drill 1.016 octagon: 1 -1.27,-1.27; 2 -1.27,1.27; 3 1.27,-1.27; 4 1.27,1.27
2X04 = drill 1.016 octagon: 1 -3.81,-1.27; 2 -3.81,1.27; 3 -1.27,-1.27; 4 -1.27,1.27; 5 1.27,-1.27; 6 1.27,1.27; 7 3.81,-1.27; 8 3.81,1.27
2X03 = drill 1.016 octagon: 1 -2.54,-1.27; 2 -2.54,1.27; 3 0,-1.27; 4 0,1.27; 5 2.54,-1.27; 6 2.54,1.27
1X03 = drill 1.016 long: 1 -2.54,0; 2 0,0; 3 2.54,0
IND_BLM03_0201_MUR = smd 0.559 x 0.33: 1 -0.394,0; 2 0.394,0
RESC2012X60N = smd 0.95 x 1.4: 1 -0.95,0; 2 0.95,0
SWITCH-TACT_DTSM-6 = smd 1.55 x 1.3: 1 -3.975,2.25; 2 3.975,2.25; 3 -3.975,-2.25; 4 3.975,-2.25
SON95P300X300X100-7N = smd 0.84 x 0.4: 1 -1.435,0.95; 2 -1.435,0; 3 -1.435,-0.95; 4 1.435,-0.95; 5 1.435,0; 6 1.435,0.95 | smd 1.625 x 2.365: 7 0,0
LED_SML-P11UTT86R = smd 0.5 x 0.6: A 0.45,0; C -0.45,0
ECSTXO3225MV400TR = smd 1.3 x 1.1: 1 -1.15,-0.95; 2 1.15,-0.95; 3 1.15,0.95; 4 -1.15,0.95

### Placement (x,y rotation side)
AIRSPEED  5.71,24.46 90 top
BAR  43.41,12.22 270 top
C1  55.82,9.63 0 top
C4  47.87,7.46 180 top
C5  16.31,27.25 90 top
C6  43.38,8.76 0 top
C7  45.85,12.42 270 top
C8  43.74,7.24 0 top
C9  21.44,14.02 0 top
C10  24.18,3.48 0 top
C12  27.5,16.5 0 top
C23  30.55,16.49 180 top
C24  21.72,16.81 0 top
C25  55.22,7.39 0 top
C26  47.5,3.95 90 top
C27  34.64,40.19 90 top
C28  49.95,30.74 270 top
C29  34.27,33.75 0 top
C30  47.54,30.76 270 top
C31  43.96,17.86 180 top
C32  34.19,14.67 180 top
C33  28.48,19.66 90 top
C34  30.85,19.64 90 top
C39  33.69,35.89 0 top
C40  26.08,19.7 90 top
D1  56.67,4.06 0 top
FB1  27.53,14.62 0 top
IC1  38.89,25.74 0 top
IMU  21.39,8.94 90 top
J2  58.7,11.11 90 top
JP1  35.69,3.81 0 top
JP2  15.88,20.19 270 top
JP3  45.34,45.85 0 top
JP4  57.91,37.34 270 top
JP5  24.26,43.18 180 top
JP6  50.98,16.48 180 top
JP7  34.16,45.85 0 top
JP8  58.04,21.72 270 top
L3  19.71,13.11 180 top
L7  44.48,9.98 180 top
R1  51.68,43.34 90 top
R2  43.64,14.99 0 top
R3  39.5,11.94 270 top
R6  48.1,9.7 180 top
R7  47.11,39.09 270 top
R8  17.83,33.88 90 top
R9  16.33,30.3 270 top
R10  12.27,8.97 90 top
R11  28.83,27.56 0 top
R12  47.96,26.21 0 top
R13  47.96,24.74 0 top
R14  17.65,14.1 270 top
R16  22.73,1.91 180 top
R17  3.56,35.43 180 top
R18  36.96,8.38 270 top
S1  40.72,39.29 0 top
U2  51.03,3.99 270 top
U$1  50.59,9.7 90 top
U$3  49.45,42.28 0 top
Y1  24.51,29.84 270 top

### Tracks (layer width: path | path; a pad name or v marks a point on that pad's centre or on a via)
3V3  (via drill 0.35)
  Top 0.203: 47.5,5.2 C26.2 | IC1.19 36.14,16.02 35.57,15.45 C32.1 35.57,14.41 34.56,13.4 28.63,13.4 v28.61,13.38 28.33,13.66 FB1.2 | R6.2 46.28,9.7 v45.97,9.4 45.45,9.4 L7.1 45.67,9.98 47.37,11.68 47.37,12.45 46.82,13 C7.1 45.39,13 44.93,12.54 BAR.6 | IC1.64 33.16,33.47 | v32.13,37.39 32.86,36.66 C39.1 32.86,33.77 C29.1 32.89,33.74 33.16,33.47 | IC1.1 33.16,33.47 | IC1.32 44.79,17.86 C31.1 45.34,16.51 v45.47,16.38 45.47,15.62 44.96,15.11 44.34,15.11 R2.2 | IC1.48 47.28,32.14 C30.1 49.93,32.14 C28.1 51.42,32.12 v51.56,32.26 | JP7.2 v31.11,47.12 | JP8.8 60.64,19.24 | 60.64,19.24 v60.71,19.3 60.71,21.59 JP8.4 | JP8.6 59.44,20.45 60.64,19.24 | JP1.5 35.69,1.27 v35.69,1.02 | v19.43,14.35 19.32,14.24 L3.2 18.66,12.45 v18.41,12.45 | IMU.11 21.89,5.67 23.6,3.96 C10.1 22.55,3.48 v22.48,3.56 | BAR.5 45.29,14.35 v45.72,14.35 | BAR.2 41.36,11.89 41.15,11.68 41.15,10.92 40.77,10.54 40.26,10.54 v39.5,9.78 R3.2 | Y1.1 21.2,31 v21.08,31.11 | Y1.4 25.46,32.96 v25.27,33.15 | R9.1 18,31.15 v18.03,31.11 | AIRSPEED.2 14.61,28.06 14.86,27.81 16.29,27.81 C5.2 17.55,27.83 v17.78,28.07 | R8.2 17.83,36.14 v17.78,36.2
  Top 0.305: v45.97,9.4 45.97,8.53 C4.2 47.05,5.55 47.5,5.1 47.5,5.2 47.89,5.2 v48.89,4.19 | U2.4 49.29,2.55 v49.02,2.29
  Bottom 0.203: v18.41,12.45 17.65,12.45 17.4,12.19 17.4,4.83 18.67,3.56 v22.48,3.56
  Bottom 0.305: v49.02,2.29 48.89,2.41 v48.89,4.19
  pour Route15: 0,50.8 63.5,50.8 63.5,0 0,0
5V  (via drill 0.35)
  Top 0.305: v51.18,6.73 51.25,6.73 51.98,6 U2.1 52,5.41 53.96,5.41 54.97,4.4 D1.1 | 55.32,19 JP8.5 | 55.32,19 55.32,12.54 56.64,11.22 C1.2 56.6,9.59 C25.2 56.6,5.7 D1.1 | 55.32,19 55.32,21.54 JP8.3 | v45.34,3.81 44.77,3.24 | 44.77,3.24 44.07,2.54 JP1.11 | 44.77,3.24 40.2,3.24 JP1.9 | D1.1 53.46,2.55 U2.6
  Bottom 0.305: v51.18,6.73 50.67,6.22 49.52,6.22 49.38,6.35 46.61,6.35 45.34,5.08 v45.34,3.81
5V_IN
  Top 0.305: JP8.7 56.59,17.73 56.59,11.92 57.51,11.01 57.51,10.27 57.95,9.83 58.68,9.83 J2.1 58.41,9.52 57.98,9.52 57.67,9.21 57.67,4.76 D1.2
BOOT0  (via drill 0.35)
  Top 0.203: v39.96,34.17 37.72,34.17 36.76,33.21 36.76,32.71 37.14,32.32 IC1.60 | R7.1 47.11,41.46 v46.69,41.88 46.61,41.96 JP3.5
  Bottom 0.203: v39.96,34.17 40.35,33.78 44.15,33.78 45.8,35.43 45.8,41 v46.69,41.88
CSB_ACCEL  (via drill 0.35)
  Top 0.203: R12.2 51.11,26.21 v51.18,26.29 | IMU.14 20.32,7.71 20.32,5.46 20.22,5.36 v20.14,5.36
  Bottom 0.203: v51.18,26.29 52.07,25.4 52.07,24.13 47.5,19.56 44.45,19.56 42.42,21.59 35.43,21.59 34.16,20.32 34.16,17.14 27.69,10.67 26.8,10.67 25.78,9.65 25.78,7.49 24.51,6.22 20.83,6.22 20.7,6.1 20.64,6.03 20.14,5.53 v20.14,5.36
CSB_GYRO  (via drill 0.35)
  Top 0.203: IMU.5 21.89,12.36 23.24,13.72 v24.51,13.72 | v50.29,24.77 50.27,24.74 R13.2
  Bottom 0.203: v50.29,24.77 45.72,20.19 44.96,20.19 42.8,22.35 35.31,22.35 33.15,20.19 33.15,16.76 28.32,11.94 26.04,11.94 24.51,13.46 v24.51,13.72
EXTI0  (via drill 0.35)
  Top 0.203: IMU.16 15.57,8.94 v15.49,9.02 | v15.75,12.32 16.96,12.32 17.65,13.01 R14.2
  Bottom 0.203: v15.49,9.02 15.49,12.06 v15.75,12.32
EXTI2
  Top 0.203: IMU.12 21.39,5.03 21.77,4.64 21.77,2.29 R16.2 22.15,1.22 22.35,1.02 24.89,1.02 28.96,5.08 JP1.2
EXTI3
  Top 0.203: AIRSPEED.5 1.31,35.1 1.65,35.43 R17.2
EXTI4
  Top 0.203: JP1.8 R18.2
GND  (via drill 0.35)
  Top 0.203: U$1.C 50.59,7.72 v49.88,7 | IC1.63 C29.2 35.65,34.76 C39.2 34.52,36.84 v34.15,37.22 | IC1.12 31.79,23.99 30.85,23.05 C34.2 30.35,21.02 29.68,21.69 29.68,22.14 | C40.2 26.11,21.04 C33.2 28.58,21.04 29.68,22.14 | C23.2 29.88,16.64 v29.88,15.05 | IC1.18 35.67,19.98 35.67,16.11 35.52,15.97 33.38,15.97 32.81,15.4 C32.2 30.26,14.67 v29.88,15.05 | C12.2 29.77,15.05 v29.88,15.05 | 29.68,22.14 v29.68,22.35 | C25.1 53.84,9.52 v53.97,9.65 54.98,9.65 C1.1 | IC1.31 42.14,18.3 C31.2 42.58,16.47 v42.67,16.38 | IC1.47 47.16,28.99 C30.2 49.93,29.38 C28.2 51.08,30.48 v51.69,30.48 | C27.1 34.64,37.71 v34.15,37.22 | JP7.4 v37.34,47.12 | JP8.2 58.04,26.8 v58.04,27.43 | JP8.1 56.77,26.16 v58.04,27.43 | JP4.6 59.18,28.57 v58.04,27.43 | JP1.3 30.61,1.27 | JP1.1 30.61,1.27 | 30.61,1.27 v30.61,1.02 | JP2.1 14.42,21.46 v13.01,20.05 14.13,18.92 JP2.3 | U$3.C 49,41.58 v48.62,41.2 | R7.2 47.11,36.34 v46.91,36.14 | 35.48,37.22 36.75,35.94 43.59,35.94 S1.4 | v34.15,37.22 35.48,37.22 | 35.48,37.22 36.57,37.22 S1.3 | C7.2 45.85,11.68 | 45.85,11.68 45.85,11.09 v45.44,10.69 | C6.2 45.04,8.76 v45.06,8.74 45.06,7.71 C8.2 | BAR.1 42.68,10.3 42.42,10.03 v41.27,10.03 | BAR.7 45.64,11.89 45.85,11.68 | C24.2 23.32,16.82 23.75,16.38 v23.75,15.24 23.75,14.86 22.91,14.02 C9.2 | IMU.4 21.39,12.92 v21.55,13.08 | IMU.7 22.89,12.22 | IMU.6 22.39,11.72 22.89,12.22 | 22.89,12.22 23.24,12.57 v23.88,12.57 | C10.2 25.66,3.48 v25.88,3.71 | Y1.2 23.56,26.6 v23.75,26.42 | AIRSPEED.1 16.16,25.56 16.31,25.7 C5.1 17.4,26.67 17.78,26.29 v17.78,25.91
  Top 0.305: J2.5 57.57,12.41 v57.4,12.57 | v45.7,2.3 47.23,2.3 C26.1 48.36,3.43 50.47,3.43 U2.7 U2.2 51.03,5.66 50.97,5.72 50.98,5.72 50.5,6.2 49.44,6.2 48.69,6.95 C4.1 48.78,7.37 49.51,7.37 v49.88,7
  pour Top: 0,50.8 63.5,50.8 63.5,0 0,0
  pour Bottom: 0,50.8 63.5,50.8 63.5,0 0,0
  pour Route2: 0,50.8 63.5,50.8 63.5,0 0,0
GPIO_EXTI0  (via drill 0.35)
  Top 0.203: IC1.14 v34.79,22.99 v34.8,22.99 | v18.8,15.75 18.67,15.62 17.78,15.62 17.65,15.49 R14.1
  Bottom 0.203: v34.8,22.99 34.04,23.75 28.57,23.75 27.05,22.23 24.77,22.23 18.8,16.26 v18.8,15.75
GPIO_EXTI2  (via drill 0.35)
  Top 0.203: IC1.28 40.64,18.04 v40.26,17.65 | R16.1 24.85,1.91 v24.93,1.99
  Bottom 0.203: v40.26,17.65 38.99,16.38 37.21,16.38 36.58,15.75 36.58,13.72 35.81,12.95 31.37,12.95 26.42,8 26.42,5.33 27.3,4.45 27.3,1.78 26.8,1.27 25.65,1.27 v24.93,1.99
GPIO_EXTI3  (via drill 0.35)
  Top 0.203: R17.1 4.26,35.56 v6.35,35.56 | IC1.11 27.83,24.49 v27.81,24.51
  Bottom 0.203: v6.35,35.56 6.35,29.97 13.21,23.11 26.42,23.11 v27.81,24.51
GPIO_EXTI4  (via drill 0.35)
  Top 0.203: R18.1 36.96,10.41 v37.34,10.79 | IC1.20 36.64,16.19 v37.3,15.54
  Bottom 0.203: v37.3,15.54 37.72,15.11 37.72,11.18 v37.34,10.79
I2C1_SCL  (via drill 0.35)
  Top 0.203: JP5.1 28.45,44.45 v29.97,42.93 | v36.7,29.72 36.64,29.78 IC1.61
  Bottom 0.203: v29.97,42.93 30.86,42.04 30.86,34.42 35.81,29.46 36.45,29.46 v36.7,29.72
I2C1_SDA  (via drill 0.35)
  Top 0.203: IC1.62 36.14,30.3 v35.09,29.25 | v28.83,41.91 JP5.2
  Bottom 0.203: v35.09,29.25 30.35,33.99 30.35,40.39 v28.83,41.91
I2C2_SCL  (via drill 0.35)
  Top 0.203: IC1.29 41.14,15.37 41.53,14.99 R2.1 42.68,14.61 42.68,14.22 | 42.68,14.22 BAR.4 | JP1.12 40.51,6.6 v40.51,9.02 | v40.77,13.37 41.62,14.22 42.68,14.22
  Bottom 0.203: v40.51,9.02 40.51,13.11 v40.77,13.37
I2C2_SDA  (via drill 0.35)
  Top 0.203: R3.1 42.66,12.52 BAR.3 | IC1.30 41.64,15.84 v41.84,15.65 | v40.51,14.48 39.5,13.46 R3.1 | R3.1 38.81,12.52 38.48,12.19 38.48,8.64 39.5,7.62 JP1.10
  Bottom 0.203: v41.84,15.65 40.59,14.4 v40.51,14.48
I2C3_SCL
  Top 0.203: IC1.8 29.12,25.99 29.08,26.04 25.02,26.04 24.64,25.65 21.21,25.65 19.68,27.18 19.68,32.13 18.78,33.03 | AIRSPEED.4 17.8,33.06 R8.1 18.78,33.03 | JP5.4 24.26,38.51 18.78,33.03
I2C3_SDA
  Top 0.203: AIRSPEED.3 14.78,30.56 14.99,30.35 14.99,29.59 15.12,29.45 R9.2 17.64,29.45 17.65,29.46 18.67,28.45 18.67,26.42 20.26,24.83 | 20.26,24.83 20.32,24.77 26.16,24.77 26.89,25.49 IC1.9 | JP2.2 19.3,21.46 20.26,22.42 20.26,24.83
IMU_INT2
  Top 0.203: IMU.1 18.82,11.18 13.21,11.18 12.27,10.24 R10.2
IMU_INT4  (via drill 0.35)
  Top 0.203: R10.1 12.27,7.54 v13.97,5.84 | v21.08,2.67 20.89,2.86 IMU.13
  Bottom 0.203: v13.97,5.84 17.14,2.67 v21.08,2.67
LED_R  (via drill 0.35)
  Top 0.203: JP3.7 49.44,44.29 51.56,44.29 | 51.56,44.29 R1.2 | IC1.33 45.7,21.99 v46.1,21.59 | v49.25,40.21 51.51,40.21 52.96,41.66 52.96,42.89 51.56,44.29
  Bottom 0.203: v46.1,21.59 46.1,33.22 49.25,36.37 v49.25,40.21
N$1
  Top 0.203: IC1.39 47.12,24.99 R13.1
N$2
  Top 0.203: R1.1 51.57,42.28 U$3.A
N$3
  Top 0.203: Y1.3 27.82,28.7 28.25,28.27 R11.1
N$4
  Top 0.203: IC1.40 45.94,25.49 46.66,26.21 R12.1
N$5
  Top 0.203: R6.1 49.5,10.15 U$1.A
N$6
  Top 0.203: BAR.8 44.13,10.03 L7.2 44,9.91 43.31,9.91 42.8,9.4 C6.1 42.8,7.33 C8.1
N$8
  Top 0.203: C24.1 20.87,14.16 | 20.87,14.16 C9.1 | IMU.3 20.89,13.08 | 20.89,13.08 20.89,14.14 20.87,14.16 | L3.1 20.86,13.11 20.89,13.08
NRST  (via drill 0.35)
  Top 0.203: C27.2 33.42,40.36 33.42,39.52 | 33.42,39.52 33.42,38.68 32.97,38.23 32,38.23 31.37,37.59 29.72,37.59 v29.21,37.08 | 33.42,39.52 34.58,40.68 35.71,40.68 | S1.2 43.82,40.68 37.69,40.68 | 35.71,40.68 37.69,40.68 | 35.71,40.68 36.58,41.54 S1.1 | JP3.2 38.25,43.84 38.25,41.23 37.69,40.68 | IC1.7 32,26.49 31.75,26.49 31.04,26.49 v30.86,26.67
  Bottom 0.203: v30.86,26.67 30.86,32.26 29.08,34.04 29.08,36.96 v29.21,37.08
OSC_IN
  Top 0.203: IC1.5 29.47,27.49 R11.2
SPI1_MISO  (via drill 0.35)
  Top 0.203: IC1.22 37.64,18.24 38.99,16.89 38.99,14.48 31.88,7.37 JP1.4 30.23,6.73 26.8,6.73 25.15,5.08 v23.62,5.08 23.37,5.08 22.39,6.06 IMU.10 | IMU.15 19.89,6.04 v18.54,4.7
  Bottom 0.203: v18.54,4.7 18.92,4.32 22.86,4.32 v23.62,5.08
SPI1_MOSI  (via drill 0.35)
  Top 0.203: IC1.23 38.14,18.5 39.47,17.17 39.47,13.94 34.42,8.89 v34.42,7.75 JP1.6 | IMU.9 22.89,6.07 23.11,5.84 24.77,5.84 27.43,8.51 v30.61,8.51
  Bottom 0.203: v30.61,8.51 33.66,8.51 v34.42,7.75
SPI1_SCK
  Top 0.203: IC1.21 37.14,17.59 38.1,16.64 38.1,14.61 32.66,9.17 29.49,9.17 29.26,8.94 23.67,8.94 | IMU.8 23.62,8.94 23.67,8.94 | JP2.4 22.99,18.92 25.4,16.51 25.4,10.67 23.67,8.94
SPI2_MISO
  Top 0.203: IC1.35 49.27,22.99 50.98,21.29 JP6.2
SPI2_MOSI
  Top 0.203: IC1.36 51.31,23.49 53.52,21.29 JP6.1
SPI2_SCK
  Top 0.203: JP6.3 48.44,20.78 46.72,22.49 IC1.34
SWCLK
  Top 0.203: IC1.49 45.32,34.16 45.32,35.82 45.77,36.27 45.77,42.32 45.34,42.75 45.34,45.85 JP3.6
SWDIO
  Top 0.203: IC1.46 44.63,28.51 44.62,28.51 43.71,28.51 43.51,28.71 43.51,29.75 45.42,31.65 45.42,33.2 48.11,35.9 48.11,40.64 47.89,40.86 47.89,46.26 48.74,47.12 JP3.8
SWO  (via drill 0.35)
  Top 0.203: JP3.4 42.8,48.39 v42.8,48.51 | v39.83,33.02 39.64,32.84 IC1.55
  Bottom 0.203: v42.8,48.51 42.8,46.59 42.03,45.82 41.01,45.82 39.27,44.08 39.27,33.58 v39.83,33.02
USART1_RX  (via drill 0.35)
  Top 0.203: IC1.59 37.64,32.94 v37.57,33.02 | v32.89,42.8 JP7.1
  Bottom 0.203: v37.57,33.02 36.32,34.27 36.32,41.91 35.43,42.8 v32.89,42.8
USART1_TX  (via drill 0.35)
  Top 0.203: IC1.58 38.14,32.46 v38.68,32.99 | v36.83,43.05 35.43,44.45 JP7.3
  Bottom 0.203: v38.68,32.99 38.68,33.2 36.83,35.05 v36.83,43.05
USART3_RX  (via drill 0.35)
  Top 0.203: JP3.1 41.53,42.93 v41.4,42.8 | v41.02,34.55 41.15,34.42 IC1.52
  Bottom 0.203: v41.4,42.8 41.4,34.93 v41.02,34.55
USART3_TX  (via drill 0.35)
  Top 0.203: IC1.51 41.64,34.1 v42.16,34.62 | v42.93,42.8 44.07,43.94 JP3.3
  Bottom 0.203: v42.16,34.62 42.16,42.04 v42.93,42.8
USB_DN
  Top 0.203: IC1.44 52,27.49 56.64,32.13 JP4.5
USB_DP
  Top 0.203: IC1.45 50.98,27.99 53.85,30.86 53.85,36.96 54.04,37.15 54.23,37.34 JP4.3
VDDA/VREF+
  Top 0.203: IC1.13 33.13,23.47 32.31,23.47 32.11,23.27 32.11,19.64 30.73,18.26 | 30.73,18.26 C34.1 30.96,18.37 31.37,17.96 C23.1 | 30.73,18.26 28.5,18.26 C33.1 26.11,18.28 C40.1 26.08,17.1 C12.1 26.73,16.45 FB1.1

### Text on the board
tPlace: 3V3 | GND | NRST | SWO | SWCLK | SWDIO | Project Dragonfly | UART1 | I2C1 | LED_R | UART3 | RX | TX | RX | TX | BOOT | Danny C / Teagan C / Noah L / Jesus O / Marko R | Thanks to / HandLED Team | GND | I2C3 | GND | GND | 5V | 3V3 | GND | 5V | 3V3 | 5V_IN | 3V3 | SPI2 | SPI1 | I2C2 | GND | 3V3 | 5V